# Altium project 遥控器.PrjPcb
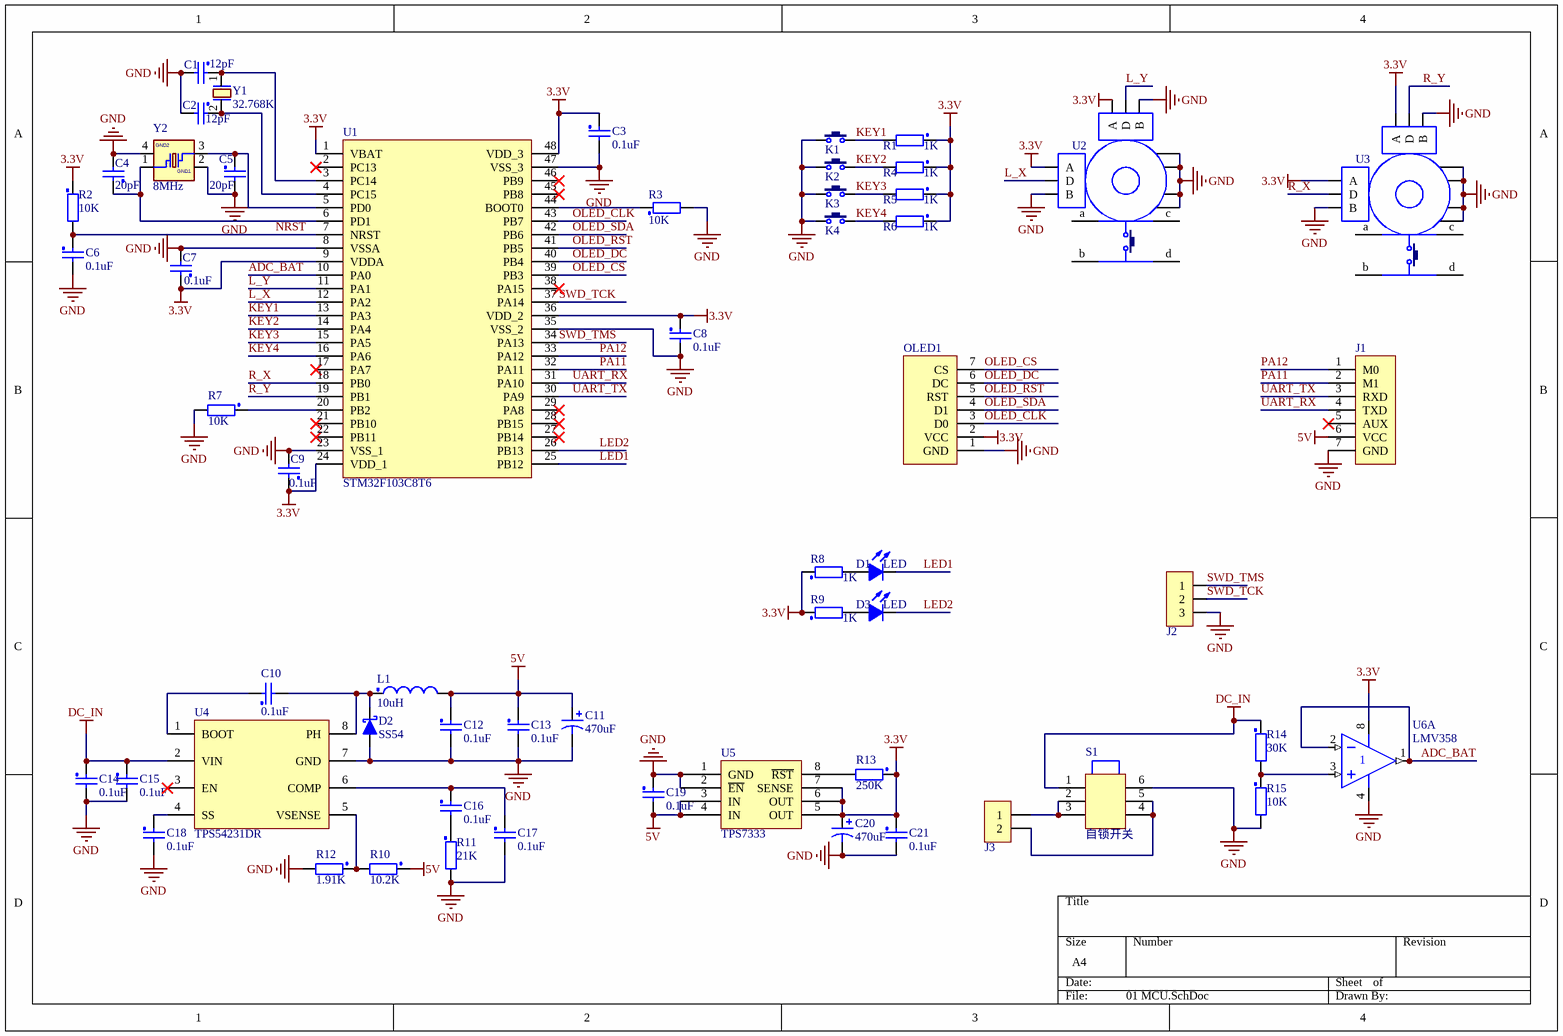
[diagram p0: 01 MCU.SchDoc]
1 sheet, 57 parts. Net scope: global (net labels, ports and power ports of the same name join across sheets).
Board file: 遥控器.PcbDoc

## Sheet 01 MCU.SchDoc
size A4

### Parts
C1  12pF  [cap0603]
C2  12pF  [cap0603]
C3  0.1uF  [cap0603]
C4  20pF  [cap0603]
C5  20pF  [cap0603]
C6  0.1uF  [cap0603]
C7  0.1uF  [cap0603]
C8  0.1uF  [cap0603]
C9  0.1uF  [cap0603]
C10  0.1uF  [cap0603]
C11  470uF  [Cap8x10.5mm]
C12  0.1uF  [cap0603]
C13  0.1uF  [cap0603]
C14  0.1uF  [cap0603]
C15  0.1uF  [cap0603]
C16  0.1uF  [cap0603]
C17  0.1uF  [cap0603]
C18  0.1uF  [cap0603]
C19  0.1uF  [cap0603]
C20  470uF  [Cap8x10.5mm]
C21  0.1uF  [cap0603]
D1  LED  [LED]
D2  SS54  [SMA(DO-214AC)]
D3  LED  [LED]
J1  1x7m  [uart_nrf24l01]  (value not drawn)
J2  1X3  [HDR-1X3_SWD]  (value not drawn)
J3  1X2  [HDR-1X2]  (value not drawn)
K1  KEY  [key]  (value not drawn)
K2  KEY  [key]  (value not drawn)
K3  KEY  [key]  (value not drawn)
K4  KEY  [key]  (value not drawn)
L1  10uH  [CD43]
OLED1  2.541x7母排  [LQ_OLED128X64去丝印]  (value not drawn)
R1  1K  [res0603]
R2  10K  [res0603]
R3  10K  [res0603]
R4  1K  [res0603]
R5  1K  [res0603]
R6  1K  [res0603]
R7  10K  [res0603]
R8  1K  [res0603]
R9  1K  [res0603]
R10  10.2K  [res0603]
R11  21K  [res0603]
R12  1.91K  [res0603]
R13  250K  [res0603]
R14  30K  [res0603]
R15  10K  [res0603]
S1  自锁开关  [6pswitch7*7mm]
U1  STM32F103C8T6  [LQFP-48_7x7x05P]
U2  手柄摇杆电位器  [摇杆]  (value not drawn)
U3  手柄摇杆电位器  [摇杆]  (value not drawn)
U4  TPS54231DR  [SOIC-8_150mil]
U5  TPS7333  [SOP8]
U6  LMV358  [OPA2350]  (part A of 2)
Y1  32.768K  [SMD3215]
Y2  8MHz  [SMD3225]

### Nets
3.3V: C3.1 C7.1 C8.1 C9.1 C20.1 C21.1 OLED1.2(VCC) R1.1 R2.1 R4.1 R5.1 R6.1 R8.1 R9.1 R13.1 U1.1(VBAT) U1.9(VDDA) U1.24(VDD_1) U1.36(VDD_2) U1.48(VDD_3) U2.3(A) U2.4(A) U3.3(A) U3.4(A) U5.5(OUT) U5.6(OUT) U5.7(SENSE) U6.8(V+)
5V: C11.1 C12.1 C13.1 C19.2 J1.6(VCC) L1.2 R10.1 U5.3(IN) U5.4(IN)
DC_IN: C14.1 C15.1 R14.1 S1.1 U4.2(VIN)
GND: C1.2 C2.2 C3.2 C4.2 C5.2 C6.2 C7.2 C8.2 C9.2 C11.2 C12.2 C13.2 C14.2 C15.2 C17.2 C18.2 C19.1 C20.2 C21.2 D2.1(A) J1.7(GND) J2.3 K1.1 K2.1 K3.1 K4.1 OLED1.1(GND) R3.2 R7.2 R11.2 R12.2 R15.2 S1.6 U1.8(VSSA) U1.23(VSS_1) U1.35(VSS_2) U1.47(VSS_3) U2.1(B) U2.6(B) U2.7 U2.8 U2.9 U2.10 U3.1(B) U3.6(B) U3.7 U3.8 U3.9 U3.10 U4.7(GND) U5.1(GND) U5.2(~{EN}) U6.4(V-) Y2.2(GND1) Y2.4(GND2)
ADC_BAT: U1.10(PA0) U6.1(OUT) U6.2(IN-)
KEY1: K1.2 R1.2 U1.13(PA3)
KEY2: K2.2 R4.2 U1.14(PA4)
KEY3: K3.2 R5.2 U1.15(PA5)
KEY4: K4.2 R6.2 U1.16(PA6)
L_X: U1.12(PA2) U2.2(D)
L_Y: U1.11(PA1) U2.5(D)
LED1: D1.2(K) U1.25(PB12)
LED2: D3.2(K) U1.26(PB13)
NRST: C6.1 R2.2 U1.7(NRST)
OLED_CLK: OLED1.3(D0) U1.43(PB7)
OLED_CS: OLED1.7(CS) U1.39(PB3)
OLED_DC: OLED1.6(DC) U1.40(PB4)
OLED_RST: OLED1.5(RST) U1.41(PB5)
OLED_SDA: OLED1.4(D1) U1.42(PB6)
PA11: J1.2(M1) U1.32(PA11)
PA12: J1.1(M0) U1.33(PA12)
R_X: U1.18(PB0) U3.2(D)
R_Y: U1.19(PB1) U3.5(D)
SWD_TCK: J2.2 U1.37(PA14)
SWD_TMS: J2.1 U1.34(PA13)
UART_RX: J1.4(TXD) U1.31(PA10)
UART_TX: J1.3(RXD) U1.30(PA9)
NetC1_1: C1.1 U1.3(PC14) Y1.1
NetC2_1: C2.1 U1.4(PC15) Y1.2
NetC4_1: C4.1 U1.6(PD1) Y2.1
NetC5_1: C5.1 U1.5(PD0) Y2.3
NetC10_1: C10.1 U4.1(BOOT)
NetC10_2: C10.2 D2.2(K) L1.1 U4.8(PH)
NetC16_1: C16.1 C17.1 U4.6(COMP)
NetC16_2: C16.2 R11.1
NetC18_1: C18.1 U4.4(SS)
NetD1_1: D1.1(A) R8.2
NetD3_1: D3.1(A) R9.2
NetJ3_1: J3.1 S1.2 S1.3
NetJ3_2: J3.2 S1.4 S1.5
NetR3_1: R3.1 U1.44(BOOT0)
NetR7_1: R7.1 U1.20(PB2)
NetR10_2: R10.2 R12.1 U4.5(VSENSE)
NetR13_2: R13.2 U5.8(~{RST})
NetR14_2: R14.2 R15.1 U6.3(IN+)

Not connected (* = marked no-connect by the designer): J1 5(AUX)*; U1 2(PC13)* 17(PA7)* 21(PB10)* 22(PB11)* 27(PB14)* 28(PB15)* 29(PA8)* 38(PA15)* 45(PB8)* 46(PB9)*; U2 a b c d; U3 a b c d; U4 3(EN)*

### Library data of the parts
C1-C10 C12-C19 C21 = Cap: 贴片电容; Published: 8-Jun-2000; LatestRevisionDate: 17-Jul-2002; LatestRevisionNote: Re-released for DXP Platform.; PackageReference: RAD-0.3; Publisher: Altium Limited
  C1 C2: Value: 12pF
  C3 C6-C10 C12-C19 C21: Value: 0.1uF
  C4 C5: Value: 20pF
C11 C20 = Cap Pol: 贴片电解电容 8*10.5mm; Published: 8-Jun-2000; LatestRevisionDate: 17-Jul-2002; LatestRevisionNote: Re-released for DXP Platform.; PackageReference: POLAR0.8; Publisher: Altium Limited; Value: 470uF
D1 D3 = LED: 贴片0805; Published: 8-Jun-2000; LatestRevisionDate: 17-Jul-2002; LatestRevisionNote: Re-released for DXP Platform.; PackageDocument: Feb-2002; PackageReference: 3.2X1.6X1.1; Publisher: Altium Limited
D2 = D Schottky: Schottky Diode; Published: 8-Jun-2000; LatestRevisionDate: 17-Jul-2002; LatestRevisionNote: Re-released for DXP Platform.; PackageReference: SMB; Publisher: Altium Limited; Code_JEDEC: DO-214-AA
J1 = 无线串口模块: 2.54mm母排座 /
J2 = Header 3: 2.54mm公排针; BOM名称: 3P接插件; 版权归属: 源创客; 学习资源: www.ooocke.com
J3 = Header 2: 不用焊; BOM名称: 2P接插件; 版权归属: 源创客; 学习资源: www.ooocke.com
K1-K4 = KEY: 按键; BOM名称: 3x6轻触开关; 版权归属: 源创客; 学习资源: www.ooocke.com
L1 = Inductor: 贴片功率电感; Code_IEC: 1005; Published: 8-Jun-2000; LatestRevisionDate: 17-Jul-2002; LatestRevisionNote: Re-released for DXP Platform.; PackageReference: 0402-A; Publisher: Altium Limited; Code_JEITA: 0402; Value: 10uH
OLED1 = OLED
R1-R15 = Res: 贴片电阻; Published: 8-Jun-2000; LatestRevisionDate: 17-Jul-2002; LatestRevisionNote: Re-released for DXP Platform.; PackageReference: AXIAL-0.4; Publisher: Altium Limited
  R1 R4-R6 R8 R9: Value: 1K
  R2 R3 R7 R15: Value: 10K
  R10: Value: 10.2K
  R11: Value: 21K
  R12: Value: 1.91K
  R13: Value: 250K
  R14: Value: 30K
S1 = 自锁开关: 按键六脚开关,自锁7*7mm
U2 U3 = 手柄摇杆电位器: 型号RKJXV1224005
U4 = TPS54231DR: DC-DC芯片,3.5V~28V输入,2A输出
U5 = TPS7333: TPS73系列电源IC
U6 = LMV358: 运放; Published: 17-Jul-2002; LatestRevisionDate: 13-Apr-2006; LatestRevisionNote: IPC-7351 Footprint Added.; DatasheetVersion: 1988; PackageReference: 751-02; Publisher: Altium Limited; PackageDescription: 8-Pin Small Outline Integrated Circuit 1.27 mm Pitch; Code_JEDEC: MS-012-AA; Code_IPC: SOIC127P600-8; ComponentLink1Description: Manufacturer Link; ComponentLink1URL: http://www.onsemi.com/site/products/parametrics/0,4446,251,00.html; ComponentLink2Description: Datasheet; ComponentLink2URL: http://www.onsemi.com/pub/Collateral/LM358-D.PDF
Y1 = CRYSTAL: 晶振 32.768KHZ 12.5PF /; CLASS: *; SILK: *; HEIGHT: *; CAD_APPROVED: *; ASSY_OPT: *; PRE_APN: *; ROHS: *; MFG_PN01: *; MFG_NAME01: *; AGILE_PN: *
Y2 = CRYSTAL_JXS63: 无源晶振 8MHZ 20pF 3.2X2.5MM SMD; CLASS: *; HEIGHT: *; CAD_APPROVED: *; ASSY_OPT: *; PRE_APN: *; ICA_MFR_NAME: *; ICA_PARTNUM: *; ROHS: *; MFG_PN01: *; MFG_NAME01: *; AGILE_PN: *; Temp_Range: *